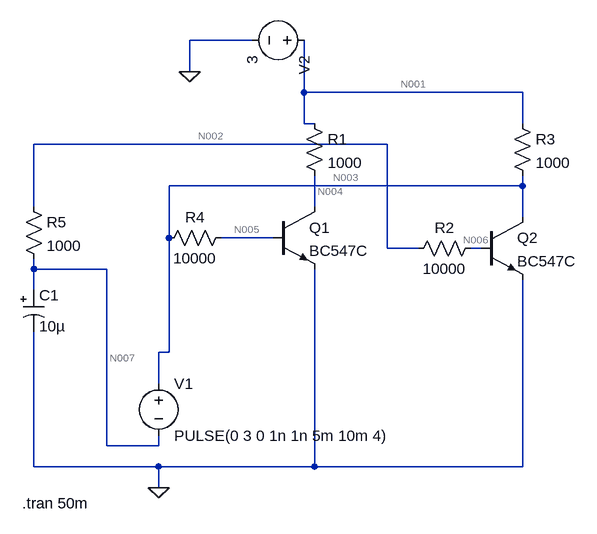
[diagram p0: schematic lights toggle.asc]
lights toggle.asc, the LTspice schematic file:
Version 4
SHEET 1 880 680
WIRE 112 -144 16 -144
WIRE 16 -96 16 -144
WIRE 192 -64 192 -144
WIRE 528 -64 192 -64
WIRE 192 -16 192 -64
WIRE 208 -16 192 -16
WIRE 528 -16 528 -64
WIRE 320 16 -224 16
WIRE 528 80 528 64
WIRE 528 80 -16 80
WIRE -224 112 -224 16
WIRE 208 112 208 64
WIRE 528 128 528 80
WIRE -16 160 -16 80
WIRE 144 160 64 160
WIRE 320 176 320 16
WIRE 368 176 320 176
WIRE 464 176 448 176
WIRE -224 208 -224 192
WIRE -112 208 -224 208
WIRE -224 240 -224 208
WIRE -16 336 -16 160
WIRE -16 336 -32 336
WIRE -32 384 -32 336
WIRE -112 480 -112 208
WIRE -32 480 -32 464
WIRE -32 480 -112 480
WIRE -224 512 -224 304
WIRE -32 512 -224 512
WIRE 208 512 208 208
WIRE 208 512 -32 512
WIRE 528 512 528 224
WIRE 528 512 208 512
WIRE -32 544 -32 512
FLAG -32 544 0
FLAG 16 -96 0
SYMBOL npn 144 112 R0
SYMATTR InstName Q1
SYMATTR Value BC547C
SYMBOL npn 464 128 R0
SYMATTR InstName Q2
SYMATTR Value BC547C
SYMBOL res 192 -32 R0
SYMATTR InstName R1
SYMATTR Value 1000
SYMBOL res 464 160 R90
WINDOW 0 0 56 VBottom 2
WINDOW 3 32 56 VTop 2
SYMATTR InstName R2
SYMATTR Value 10000
SYMBOL voltage -32 368 R0
WINDOW 123 0 0 Left 0
WINDOW 39 0 0 Left 0
SYMATTR InstName V1
SYMATTR Value PULSE(0 3 0 1n 1n 5m 10m 4)
SYMBOL voltage 208 -144 R90
WINDOW 123 0 0 Left 0
WINDOW 39 0 0 Left 0
SYMATTR InstName V2
SYMATTR Value 3
SYMBOL res 512 -32 R0
SYMATTR InstName R3
SYMATTR Value 1000
SYMBOL res 80 144 R90
WINDOW 0 0 56 VBottom 2
WINDOW 3 32 56 VTop 2
SYMATTR InstName R4
SYMATTR Value 10000
SYMBOL polcap -240 240 R0
WINDOW 3 24 56 Left 2
SYMATTR InstName C1
SYMATTR Value 10µ
SYMATTR Description Capacitor
SYMATTR Type cap
SYMATTR SpiceLine V=6.3 Irms=0 Rser=4 Lser=0 mfg="AVX" pn="TAJA106M006" type="Tantalum"
SYMBOL res -240 96 R0
SYMATTR InstName R5
SYMATTR Value 1000
TEXT -242 568 Left 2 !.tran 50m

The netlist it stands for:
* lights toggle.asc
Q1 N004 N005 0 0 BC547C
Q2 N003 N006 0 0 BC547C
R1 N001 N004 1000
R2 N006 N002 10000
V1 N003 N007 PULSE(0 3 0 1n 1n 5m 10m 4)
V2 N001 0 3
R3 N001 N003 1000
R4 N005 N003 10000
C1 N007 0 10µ V=6.3 Irms=0 Rser=4 Lser=0 mfg="AVX" pn="TAJA106M006" type="Tantalum"
R5 N002 N007 1000
.model NPN NPN
.model PNP PNP
.lib standard.bjt
.tran 50m
.backanno
.end

* Results of the author's LTspice run, read from the files saved beside the schematic
* Operating Point, zero values left out:
*   V(n004) = 567.5 mV
*   V(n005) = 645.8 mV
*   V(n003) = 700.1 mV
*   V(n006) = 644.1 mV
*   V(n001) = 3 V
*   V(n002) = 695 mV
*   V(n007) = 700.1 mV
*   Ic(Q2) = 2.289 mA
*   Ib(Q2) = 5.096 µA
*   Ie(Q2) = -2.294 mA
*   Ic(Q1) = 2.433 mA
*   Ib(Q1) = 5.434 µA
*   Ie(Q1) = -2.438 mA
*   I(R5) = -5.096 µA
*   I(R4) = -5.434 µA
*   I(R3) = 2.3 mA
*   I(R2) = -5.096 µA
*   I(R1) = 2.433 mA
*   I(V2) = -4.732 mA
*   I(V1) = 5.096 µA
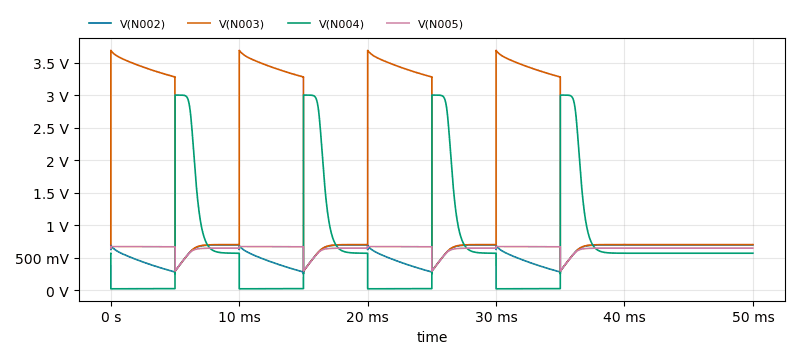
[diagram p1: Transient Analysis of lights toggle.asc, plotted from the saved traces]
* Transient Analysis, 1 run:
*   V(N002): min 247.4 mV, max 695 mV, average 567.1 mV, rms 584.8 mV, last 695 mV
*   V(N003): min 291 mV, max 3.688 V, average 1.77 V, rms 2.239 V, last 700.1 mV
*   V(N004): min 20.25 mV, max 3 V, average 673.5 mV, rms 1.111 V, last 567.5 mV
*   V(N005): min 292.1 mV, max 670 mV, average 634.2 mV, rms 637.8 mV, last 645.8 mV